# EAGLE design Grove - 96x96 OLED Display v2.1 (EAGLE 6.3)
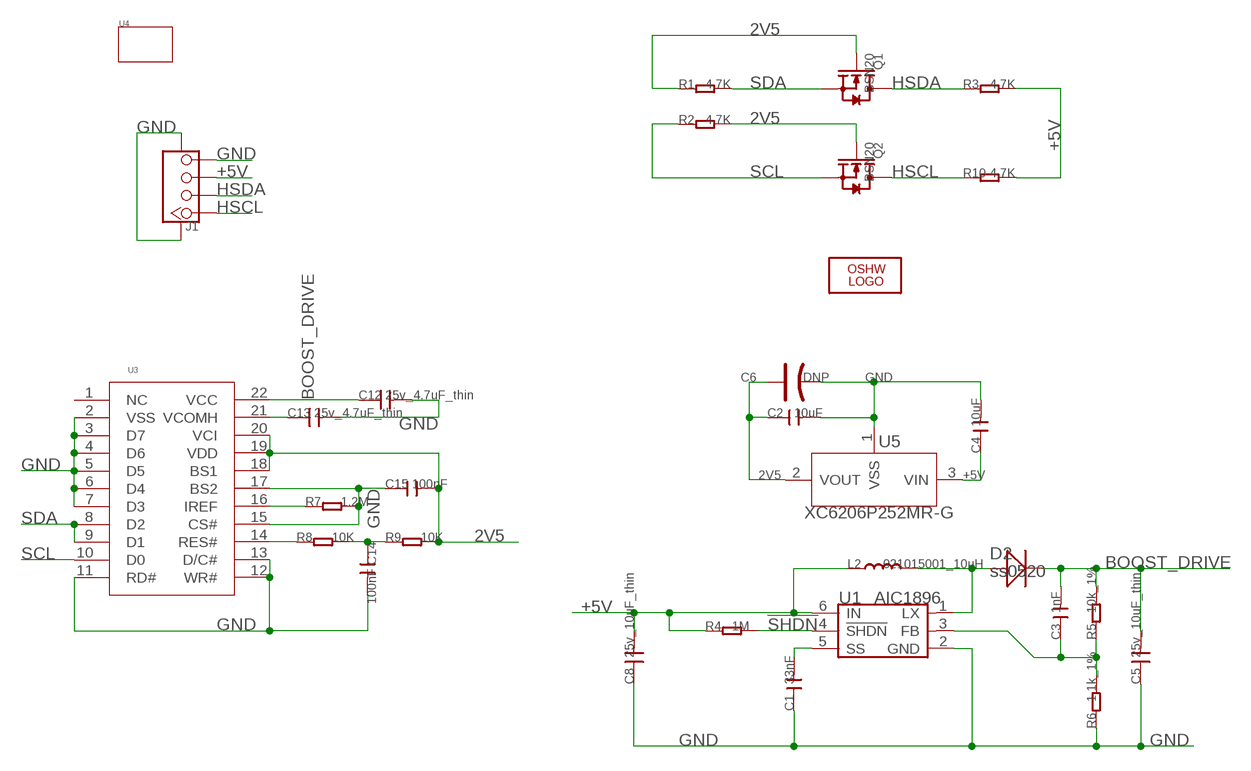
[diagram p0: schematic, sheet 1]

## Parts
C1  33nF  C-0603  [C0603]
C2  10uF  C-0805  [C0805]
C3  1nF  C-0603  [C0603]
C4  10uF  C-0805  [C0805]
C5  25v_10uF_thin  006-C0805  [0805]
C6  DNP  CAP-AVX-A  [AVX-A]
C8  25v_10uF_thin  006-C0805  [0805]
C12  25v_4.7uF_thin  006-C0805  [0805]
C13  25v_4.7uF_thin  006-C0805  [0805]
C14  100nF  C-0603  [C0603]
C15  100nF  C-0603  [C0603]
D2  ss0520  010-DSOD123  [SOD123]
J1  TWIG-4P-2.0-SMD-FEMALE-REINFORCE'90D'  [4P-SMD-2.0-90D]
L2  021015001_10uH  013-L0806  [0806]
LOGO2  LOGO-OSHW-FILLX0200-NT  [OSHW_FILLX200_NOTEXT]
Q1  BSN20  MOSFET-N'SOT23'  [SOT23]
Q2  BSN20  MOSFET-N'SOT23'  [SOT23]
R1  4.7K  R-0603  [R0603]
R2  4.7K  R-0603  [R0603]
R3  4.7K  R-0603  [R0603]
R4  1M  R-0603  [R0603]
R5  10k_1%  R-0603  [R0603]
R6  1.1k_1%  R-0603  [R0603]
R7  1.2M  005-R0603  [0603]
R8  10K  005-R0603  [0603]
R9  10K  005-R0603  [0603]
R10  4.7K  R-0603  [R0603]
U1  AIC1896  [SOT23-6]
U3  LY120-096096  [LY120-096096]
U4  TWIG-2X2U  [2X2U-DIM-W/-DRILL]
U5  XC6206P252MR-G  XC6206MR  [SOT23]

## Nets
2V5: C2.1 C6.+ C15.2 Q1.1(G) Q2.1(G) R1.1 R2.2 R9.2 U3.18(BS1) U3.19(VDD) U3.20(VCI) U5.2(VOUT)
!SHDN: R4.2 U1.4(!SHDN)
+5V: C4.1 C8.2 J1.3 L2.1 R3.2 R4.1 R10.2 U1.6(IN) U5.3(VIN)
BOOST_DRIVE: C3.2 C5.2 C12.1 D2.- R5.2 U3.22(VCC)
GND: C1.1 C2.2 C4.2 C5.1 C6.- C8.1 C12.2 C13.2 C14.2 C15.1 J1.4 J1.SS1 J1.SS2 R6.1 R7.2 U1.2(GND) U3.2(VSS) U3.3(D7) U3.4(D6) U3.5(D5) U3.6(D4) U3.7(D3) U3.11(RD#) U3.12(WR#) U3.13(D/C#) U3.15(CS#) U3.17(BS2) U5.1(VSS)
HSCL: J1.1 Q2.3(D) R10.1
HSDA: J1.2 Q1.3(D) R3.1
N$1: D2.+ L2.2 U1.1(LX)
N$2: C1.2 U1.5(SS)
N$4: C3.1 R5.1 R6.2 U1.3(FB)
N$9: C13.1 U3.21(VCOMH)
N$12: R7.1 U3.16(IREF)
N$19: R8.1 U3.14(RES#)
N$20: C14.1 R8.2 R9.1
SCL: Q2.2(S) R2.1 U3.10(D0)
SDA: Q1.2(S) R1.2 U3.8(D2) U3.9(D1)
Unconnected: U3.1(NC)

## Library data of the parts
C1-C4 C14 C15 = Discrete:C*: Ceramic Capacitors
C5 C8 C12 C13 = Discrete:006-C*: Ceramic Capacitors
C6 = Discrete:CAP*: Electrolytic Capacitors,Tantalum Capacitors and Super Capacitors
D2 = Discrete:010-D*
J1 = Connector:TWIG-4P-2.0-SMD-FEMALE-REINFORCE
L2 = Discrete:013-L*
LOGO2 = logo:LOGO-OSHW-FILL; PARTNO: DNP
Q1 Q2 = Discrete:MOSFET-N: IRLL014: http://www.vishay.com/docs/91319/sihll014.pdf
R1-R6 R10 = Discrete:R*
R7-R9 = Discrete:005-R*
U1 = ICs_v54:AIC1896
U3 = EXT_moudle:LY120-096096
U4 = Module:TWIG
U5 = IC:XC6206: LOW ESR Cap.Compatible Positive Voltage Regulators

## Net classes
0 default: width 0.203 mm, drill 0.305 mm, clearance 0.203 mm

## Board
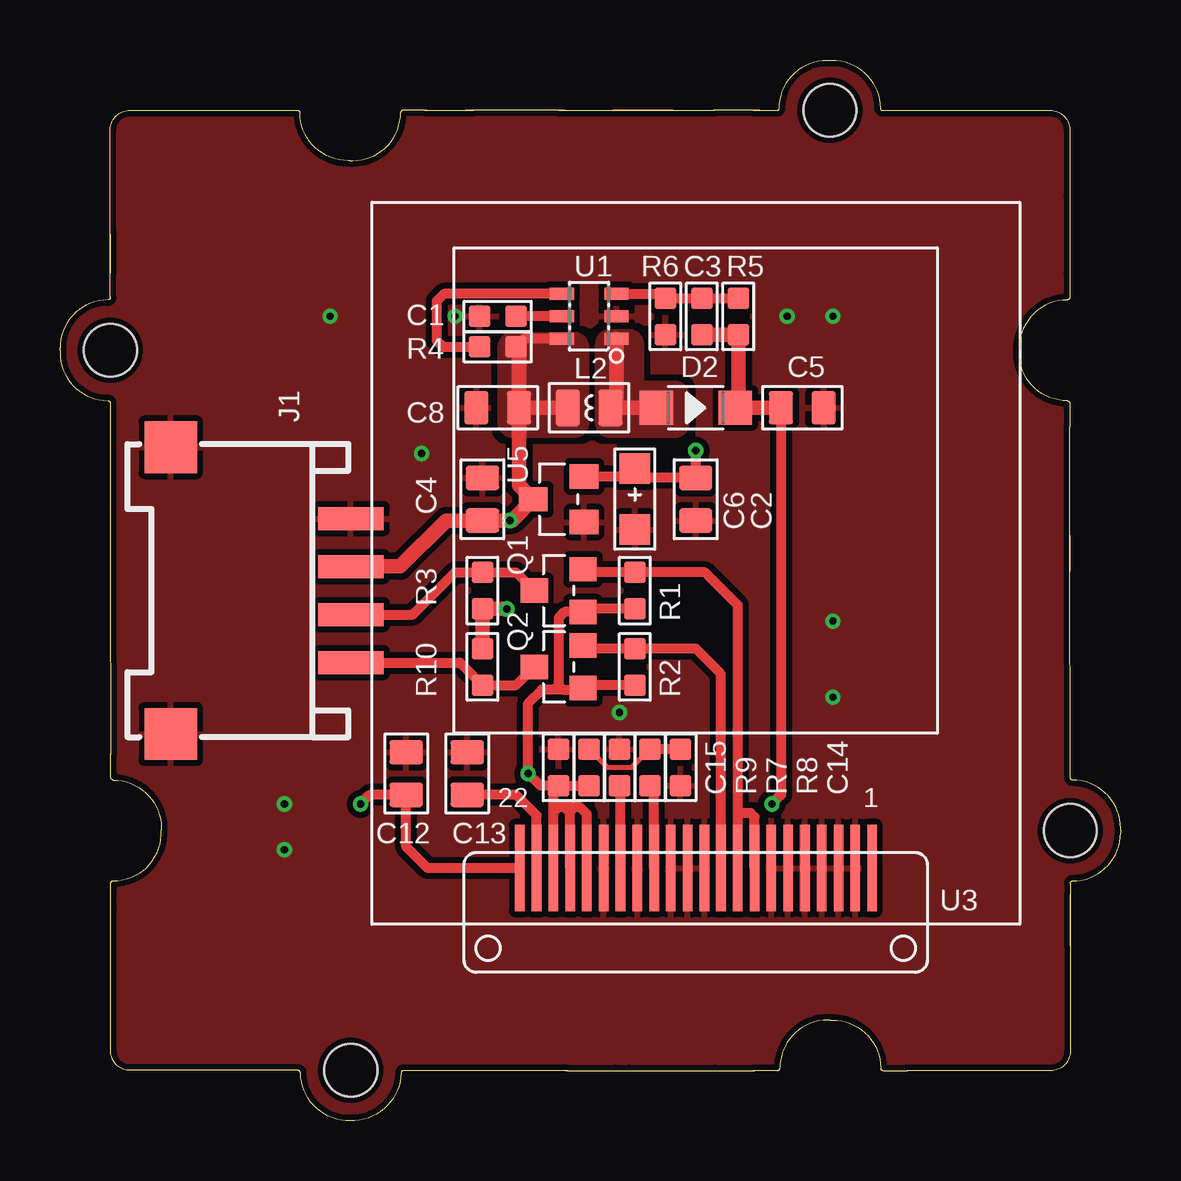
[diagram p1: board, top side]
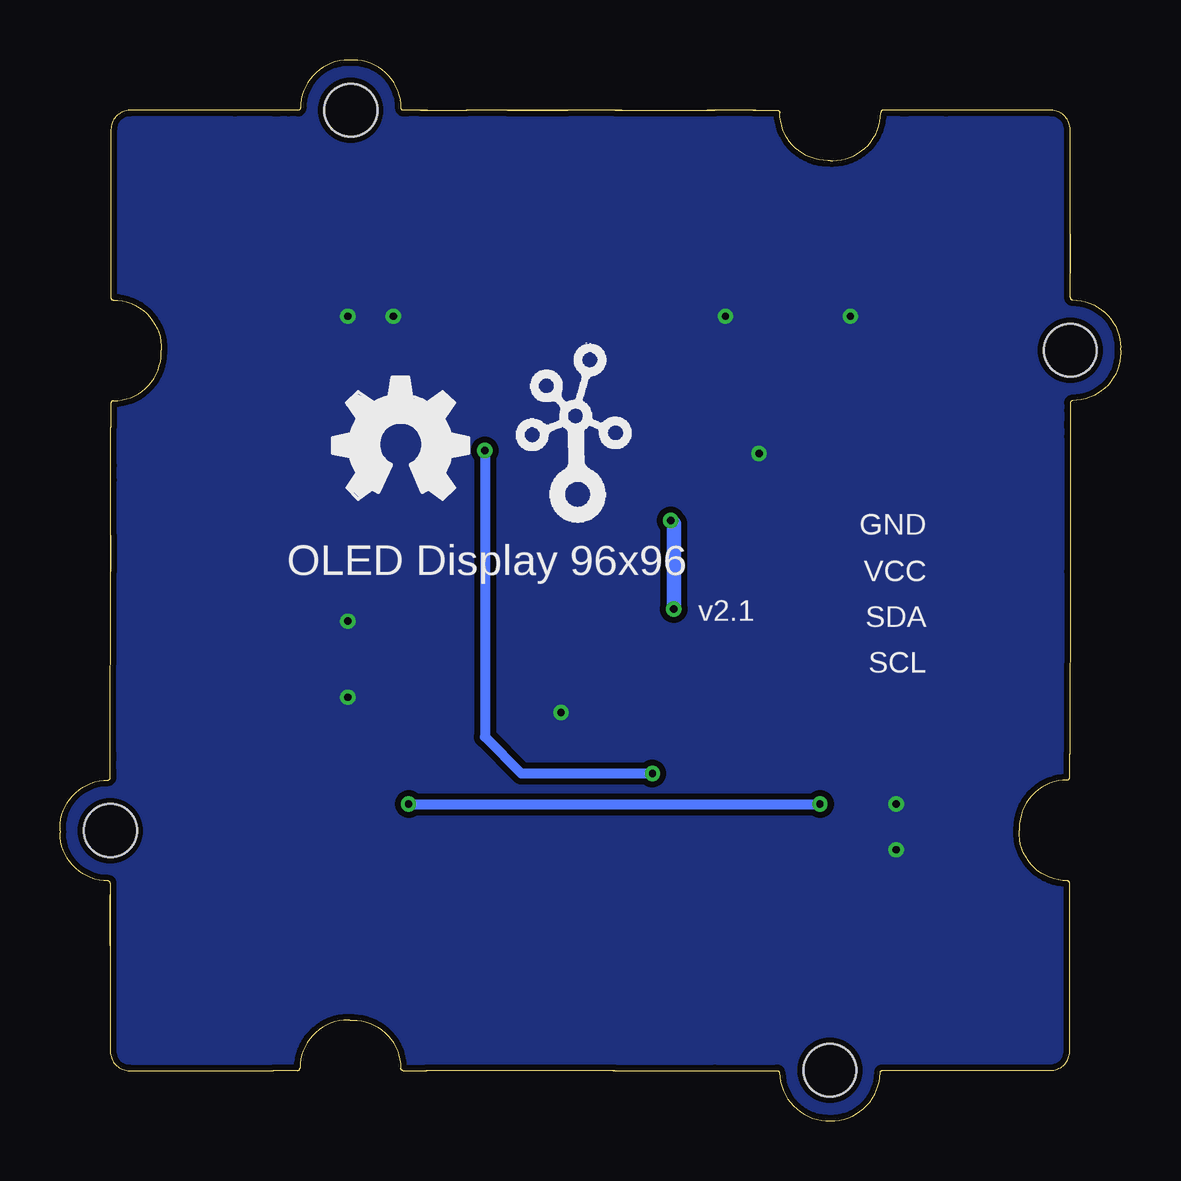
[diagram p2: board, bottom side, seen from below]

Size 44.21 x 44.2 mm. Coordinates in mm from the lower left corner, seen from the top.
Copper layers (1*16): Top 0.035mm / dielectric 1.5mm / Bottom 0.035mm
Design rules "SeeedStudio_rule_no_angle_090911 *": minimum track width 6mil, minimum drill 12mil, track to track 6mil, track to pad 6mil, pad to pad 6mil, via to via 6mil, smd to smd 0mil, copper to edge 10mil, drill to drill 10mil, minimum pad ring 10mil, minimum via ring 6mil, stop-mask expansion 2mil, vias tented up to drill 100mil, thermal gap 10mil
tRestrict: area 46.7,32.2 to 46.8,33.3; area 47.5,32.4 to 47.6,33.3; area 50.9,32.4 to 51,33.1; area 51.6,32.4 to 51.8,33.1; area 52.3,32.5 to 52.4,33.1; area 53,32.2 to 53.2,33.1; area 53.7,32.5 to 53.8,33.1

### Footprints (pad centres in the part's own frame; a part is rotated, then mirrored left to right if it is on the bottom)
C0603 = smd 0.889 x 0.889: 1 -0.762,0; 2 0.762,0
C0805 = smd 1.016 x 1.397: 1 -0.889,0; 2 0.889,0
0805 = smd 1.016 x 1.397: 1 -0.889,0; 2 0.889,0
AVX-A = smd 1.27 x 1.27: + -1.27,0; - 1.27,0
SOD123 = smd 1.397 x 1.397: + 1.651,0; - -1.651,0
4P-SMD-2.0-90D = smd 0.965 x 2.74: 1 -3,-0.1; 2 -1,-0.1; 3 1,-0.1; 4 3,-0.1 | smd 2.159 x 2.184: SS1 -5.974,7.4; SS2 5.974,7.4
0806 = smd 1.016 x 1.524: 1 -0.889,0; 2 0.889,0
SOT23 = smd 1.016 x 1.143: 1 -0.889,-1.016; 2 0.889,-1.016; 3 0,1.016
R0603 = smd 0.889 x 0.889: 1 -0.762,0; 2 0.762,0
0603 = smd 0.889 x 0.889: 1 -0.762,0; 2 0.762,0
SOT23-6 = smd 0.508 x 1.016: 1 -0.94,-1.143; 2 0,-1.143; 3 0.94,-1.143; 4 0.94,1.143; 5 0,1.143; 6 -0.94,1.143
LY120-096096 = smd 0.4 x 3.6: 1 7.35,-12.7; 2 6.65,-12.7; 3 5.95,-12.7; 4 5.25,-12.7; 5 4.55,-12.7; 6 3.85,-12.7; 7 3.15,-12.7; 8 2.45,-12.7; 9 1.75,-12.7; 10 1.05,-12.7; 11 0.365,-12.7; 12 -0.335,-12.7; 13 -1.035,-12.7; 14 -1.735,-12.7; 15 -2.435,-12.7; 16 -3.135,-12.7; 17 -3.835,-12.7; 18 -4.535,-12.7; 19 -5.235,-12.7; 20 -5.935,-12.7; 21 -6.635,-12.7; 22 -7.335,-12.7
2X2U-DIM-W/-DRILL = hole 2.2: 10.033,20.01; -19.955,10.015; -9.933,-19.99; 20.055,-9.995
SOT23' = smd 1.016 x 1.2: 1 -0.95,-1.06; 2 0.95,-1.06; 3 0,1.06

### Placement (x,y rotation side)
C1  18.25,33.52 0 top
C2  26.5,25.9 270 top
C3  26.75,33.52 270 top
C4  17.61,25.9 90 top
C5  30.95,29.71 180 top
C6  23.96,25.9 270 top
C8  18.25,29.71 0 top
C12  14.43,14.47 90 top
C13  16.98,14.47 90 top
C14  25.86,14.72 270 top
C15  20.79,14.72 270 top
D2  26.5,29.71 180 top
J1  12.02,22.09 90 top
L2  22.05,29.71 0 top
LOGO2  32.85,25.9 0 bottom
Q1  20.79,22.09 90 top
Q2  20.79,18.91 90 top
R1  23.96,22.09 90 top
R2  23.96,18.91 270 top
R3  17.61,22.09 270 top
R4  18.25,32.25 180 top
R5  28.28,33.52 270 top
R6  25.23,33.52 90 top
R7  23.32,14.72 90 top
R8  24.59,14.72 90 top
R9  22.05,14.72 270 top
R10  17.61,18.91 90 top
U1  22.05,33.52 90 top
U3  26.5,23.23 0 top
U4  22.05,22.09 0 top
U5  XC6206P252MR-G  [SOT23']  20.79,25.9 90 top
U$1  [TWIGLOGO]  22.69,25.9 0 bottom

### Tracks (layer width: path | path; a pad name or v marks a point on that pad's centre or on a via)
2V5  (via drill 0.3 pad 0.64)
  Top 0.406: C15.2 R9.2 | U5.2 23.64,26.85 C6.+ 24.34,26.79 C2.1 v26.5,27.93 | R2.2 21.67,18.15 | R1.1 21.99,21.33 21.86,21.2 Q1.1 | U3.20 20.57,12.85 | 20.57,12.85 20.57,13.07 | 20.57,13.07 20.57,13.29 | 20.57,13.29 20.57,13.74 C15.2 | U3.18 21.96,12.78 21.67,13.07 21.42,13.07 | 21.42,13.07 21.17,13.07 | 21.17,13.07 21.04,13.07 | 21.04,13.07 20.79,13.07 | 20.79,13.07 20.57,13.07 | U3.19 21.27,12.85 | 21.27,12.92 21.27,12.97 21.17,13.07 | 21.27,12.85 21.04,13.07 | 20.57,12.85 20.79,13.07 | 20.57,13.29 20.79,13.07 | 21.27,12.85 21.27,12.92 | 21.27,12.92 21.42,13.07 | 21.74,21.2 Q1.1 | 20.79,18.15 20.79,20.95 21.04,21.2 Q1.1 | 20.79,18.15 20.79,18.09 20.66,17.96 | 20.97,17.96 20.66,17.96 | 20.66,17.96 20.6,17.96 | 20.6,17.96 20.09,17.96 19.52,17.39 v19.52,14.47 20.02,13.96 C15.2 | 20.97,17.96 20.79,18.15 | 20.6,17.96 20.79,18.15 | 20.97,17.96 21.74,17.96 Q2.1 | 21.55,18.15 21.67,18.15 | 21.67,18.15 Q2.1 | 21.93,17.9 Q2.1
  Bottom 0.406: v26.5,27.93 26.5,15.99 24.98,14.47 v19.52,14.47
!SHDN
  Top 0.406: U1.4 16.01,34.46 15.71,34.16 15.71,32.5 15.96,32.25 R4.2
+5V  (via drill 0.3 pad 0.64)
  Top 0.406: U1.6 19.34,32.58 R4.1
  Top 0.61: R10.2 R3.2 v18.63,21.33 | L2.1 C8.2 | C8.2 19.13,26.49 U5.3 18.84,25.01 v18.75,25.01 C4.1 16.09,25.01 14.18,23.11 13.04,23.11 12.91,23.23 12.27,23.23 J1.3 | C8.2 19.13,32.12 R4.1
  Bottom 0.61: v18.63,21.33 18.63,24.88 v18.75,25.01
  pour Top (isolate 0.203, no thermals): 18.37,29.07 18.37,32.25 arc-90 18.88,32.76 21.42,32.76 arc-90 21.93,32.25 21.93,29.07 arc-90 21.42,28.57 18.88,28.57 arc-90
BOOST_DRIVE  (via drill 0.3 pad 0.64)
  Top 0.406: C5.2 30.06,13.58 v29.68,13.2 | U3.22 15.32,10.53 14.43,11.42 C12.1 12.91,13.58 v12.53,13.2
  Top 0.61: C5.2 D2.- 28.28,29.84 R5.2 C3.2
  Bottom 0.406: v29.68,13.2 v12.53,13.2
GND  (via drill 0.3 pad 0.64)
  other vias: 16.47,33.52 23.32,17.01 32.22,20.82 32.22,17.64 30.31,33.52 32.22,33.52 15.07,27.8 11.26,33.52 9.36,11.29 9.36,13.2
  pour Top (isolate 0.254, rank 2): -0.17,-0.14 44.28,-0.14 44.28,44.31 -0.17,44.31
  pour Bottom (isolate 0.254, rank 2): -0.17,-0.14 44.28,-0.14 44.28,44.31 -0.17,44.31
HSCL
  Top 0.406: Q2.3 19.01,18.15 R10.1 16.67,19.09 J1.1
HSDA
  Top 0.406: Q1.3 19.01,22.85 18.12,22.85 R3.1 16.47,22.85 14.71,21.09 J1.2
N$1
  Top 0.61: D2.+ L2.2 23.2,29.96 U1.1
  pour Top (isolate 0.203, no thermals): 22.44,29.07 22.44,32.38 arc-90 22.94,32.88 23.71,32.88 arc-90 24.21,32.38 24.21,30.73 25.61,30.73 arc-90 26.12,30.22 26.12,29.07 arc-90 25.61,28.57 22.94,28.57 arc-90
N$2
  Top 0.406: U1.5 C1.2
N$4
  Top 0.406: U1.3 25.05,34.46 R6.2 C3.1 R5.1
N$9
  Top 0.406: U3.21 19.86,12.72 19.01,13.58 C13.1
N$12
  Top 0.406: 23.24,13.88 R7.1 23.36,13.92 U3.16
N$19
  Top 0.406: 24.64,13.92 R8.1 24.77,13.79 U3.14
N$20
  Top 0.203: R9.1 22.82,14.72 23.83,14.72 R8.2
  Top 0.406: C14.1 R8.2
SCL
  Top 0.406: U3.10 27.55,18.63 26.5,19.68 R2.1 21.93,19.68 Q2.2
SDA
  Top 0.406: U3.9 28.25,12.66 | 28.25,12.66 28.25,12.82 | 28.25,12.82 28.25,21.48 26.88,22.85 R1.2 21.93,22.85 Q1.2 | U3.8 28.95,12.65 28.79,12.82 28.41,12.82 | 28.41,12.82 28.25,12.82 | 28.25,12.66 28.41,12.82 | 28.41,12.82 28.28,12.95

### Text on the board
bPlace: GND | VCC | OLED Display 96x96 | SDA | v2.1 | SCL